# EAGLE design Transmitter_Schematic (EAGLE 6.5.0)
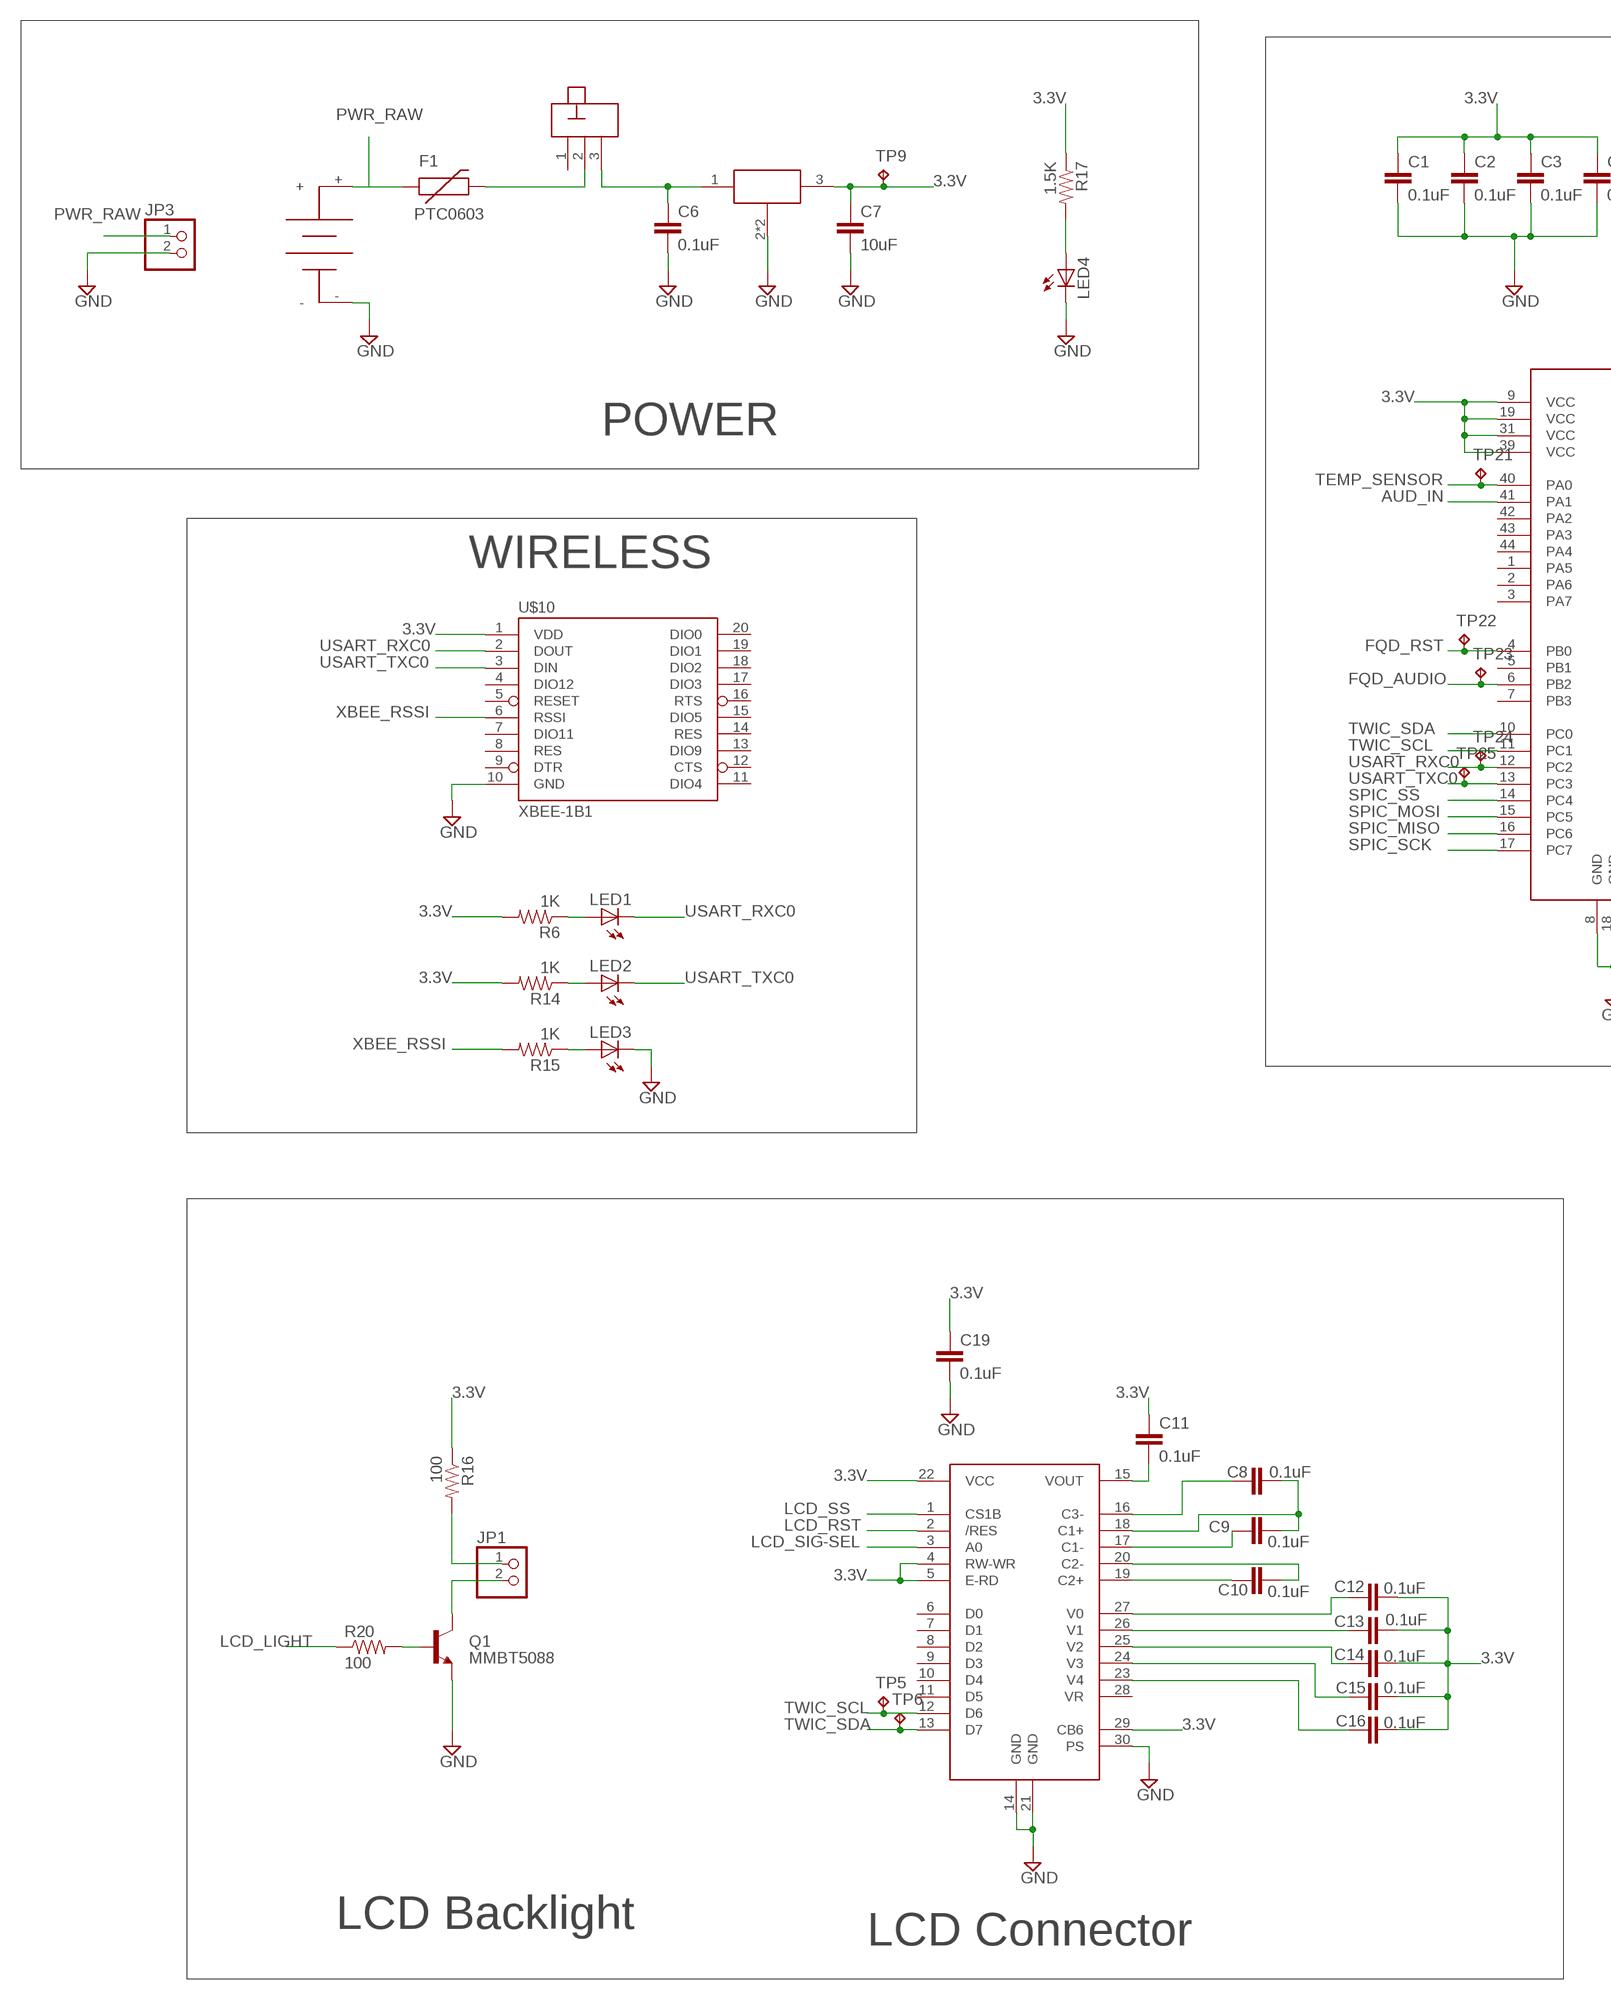
[diagram p0: schematic, sheet 1, part 1 of 2]
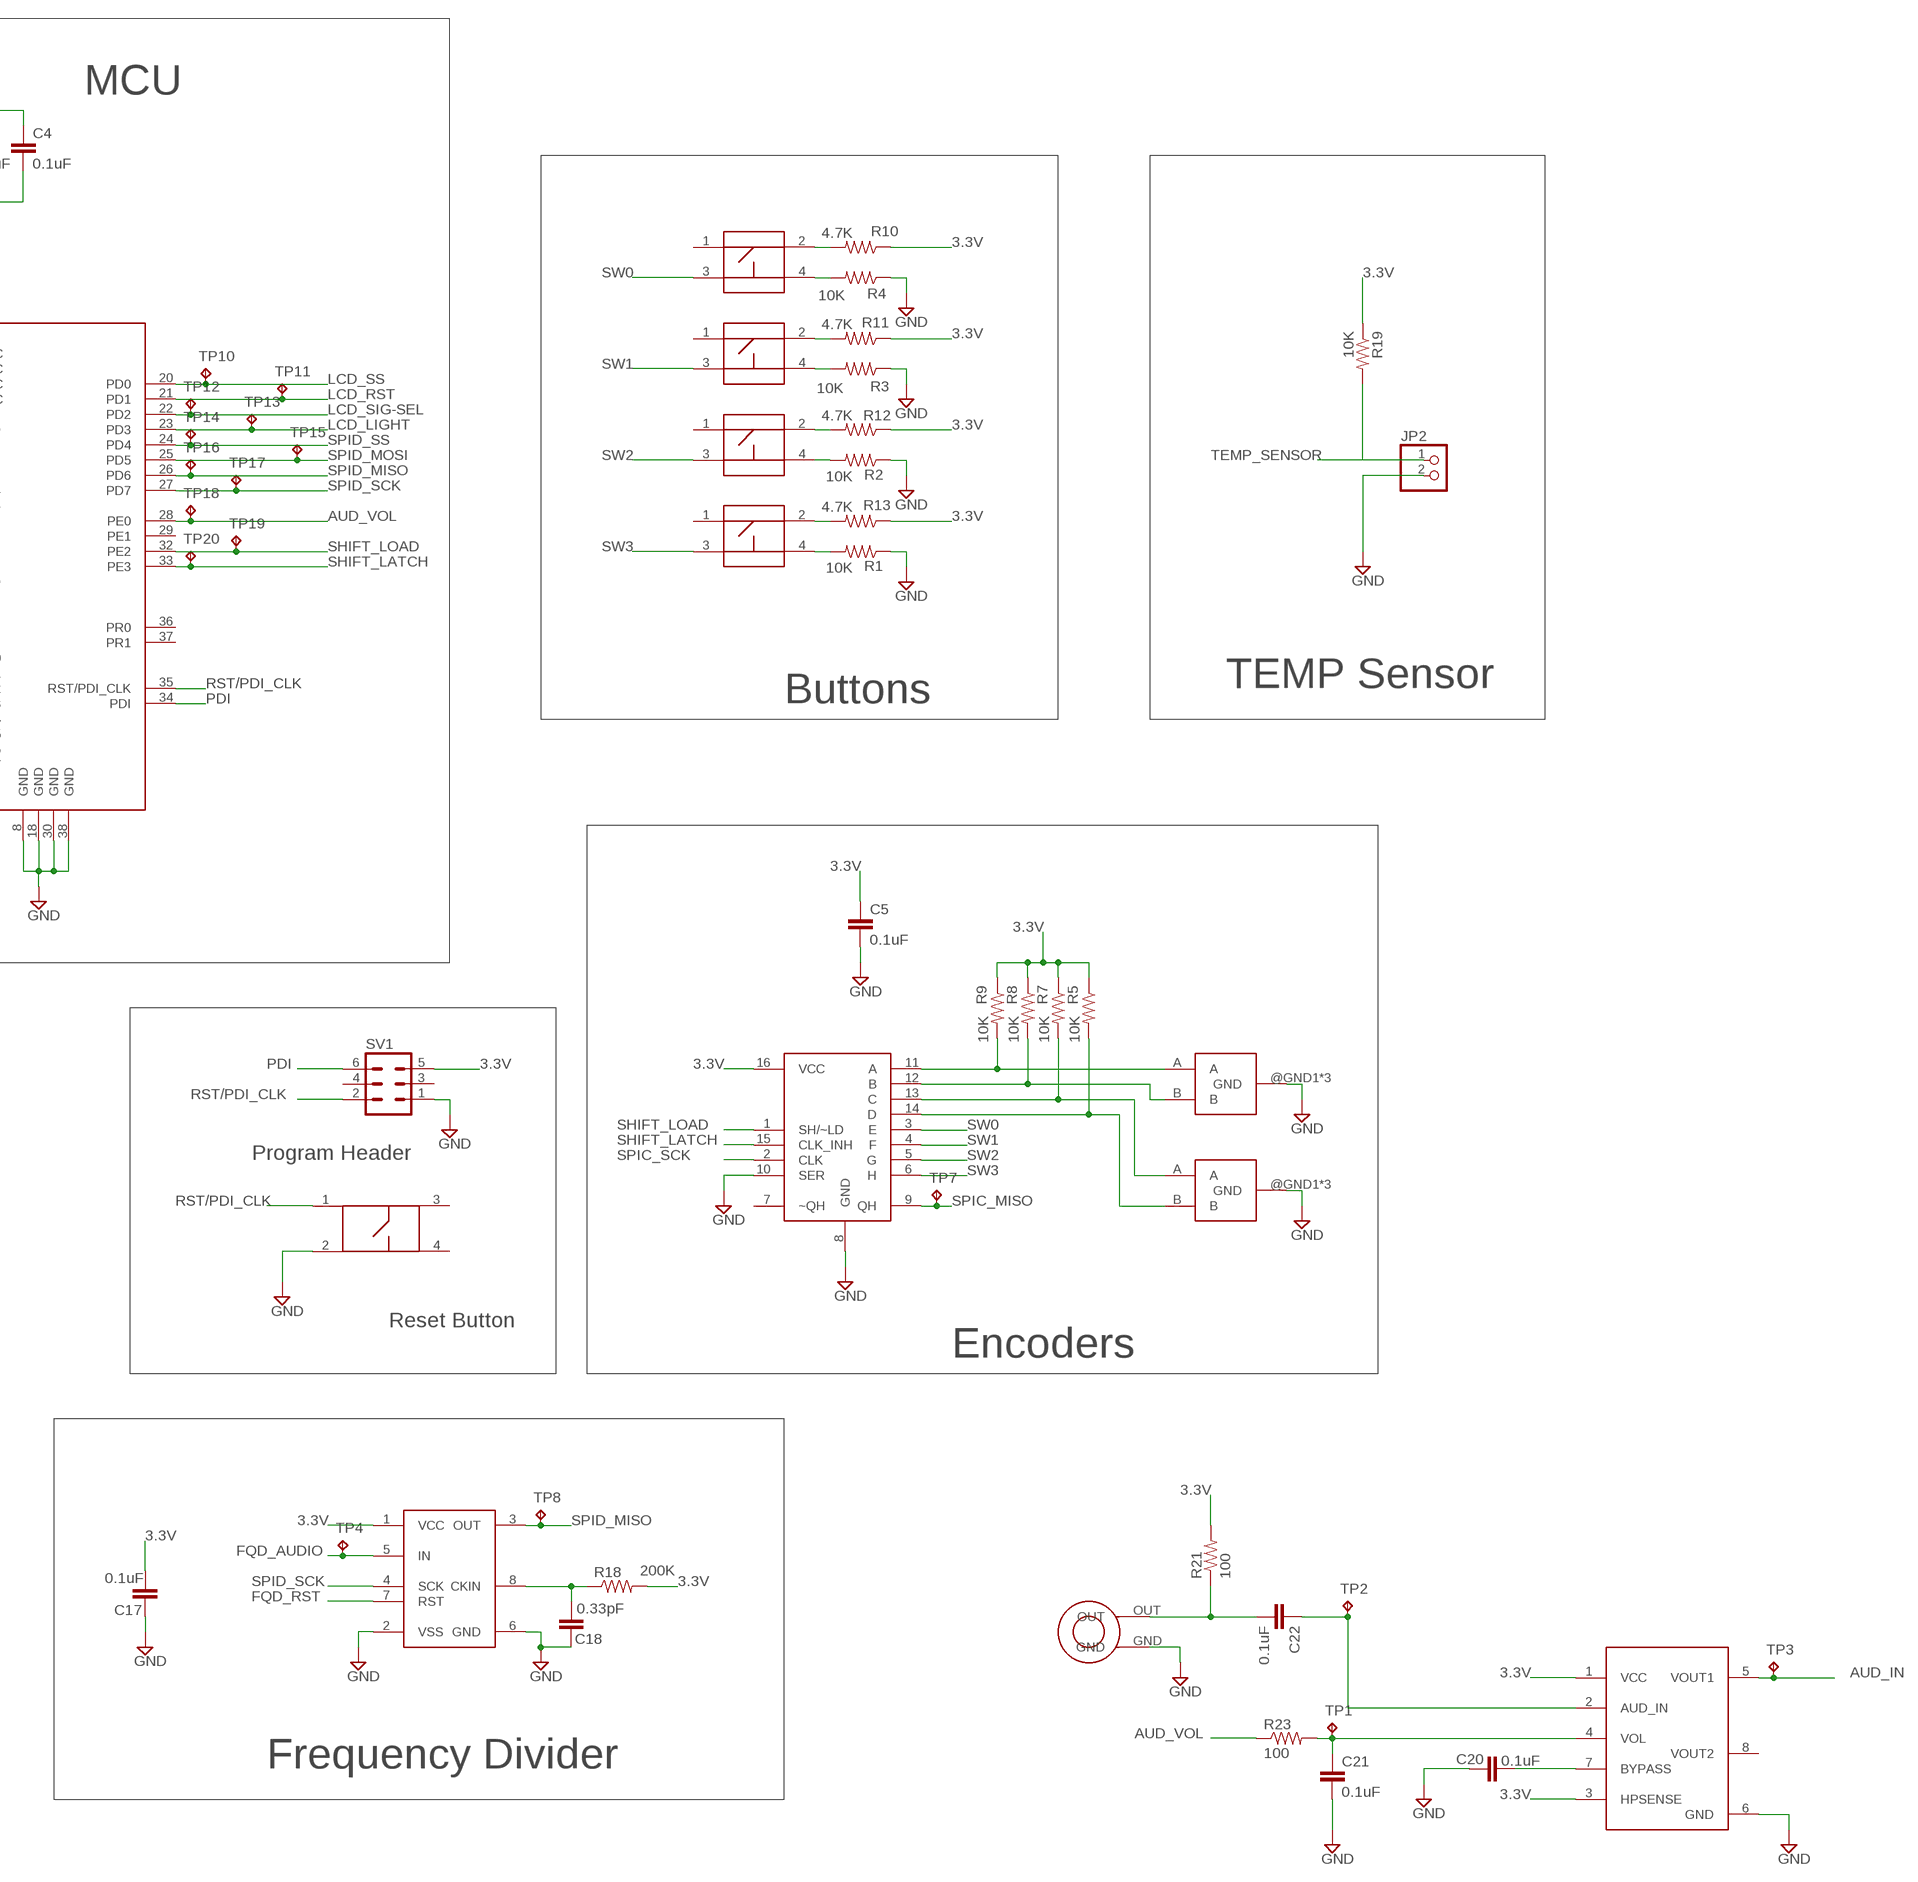
[diagram p1: schematic, sheet 1, part 2 of 2]

## Parts
C1  0.1uF  CAP0603-CAP  [0603-CAP]
C2  0.1uF  CAP0603-CAP  [0603-CAP]
C3  0.1uF  CAP0603-CAP  [0603-CAP]
C4  0.1uF  CAP0603-CAP  [0603-CAP]
C5  0.1uF  CAP0603-CAP  [0603-CAP]
C6  0.1uF  CAP0603-CAP  [0603-CAP]
C7  10uF  CAP0603-CAP  [0603-CAP]
C8  0.1uF  CAP0603-CAP  [0603-CAP]
C9  0.1uF  CAP0603-CAP  [0603-CAP]
C10  0.1uF  CAP0603-CAP  [0603-CAP]
C11  0.1uF  CAP0603-CAP  [0603-CAP]
C12  0.1uF  CAP0603-CAP  [0603-CAP]
C13  0.1uF  CAP0603-CAP  [0603-CAP]
C14  0.1uF  CAP0603-CAP  [0603-CAP]
C15  0.1uF  CAP0603-CAP  [0603-CAP]
C16  0.1uF  CAP0603-CAP  [0603-CAP]
C17  0.1uF  CAP0603-CAP  [0603-CAP]
C18  0.33pF  CAP0603-CAP  [0603-CAP]
C19  0.1uF  CAP0603-CAP  [0603-CAP]
C20  0.1uF  CAP0603-CAP  [0603-CAP]
C21  0.1uF  CAP0603-CAP  [0603-CAP]
C22  0.1uF  CAP0603-CAP  [0603-CAP]
F1  PTC0603  [0603]
JP1  PINHD-1X2  [1X02]
JP2  PINHD-1X2  [1X02]
JP3  PINHD-1X2  [1X02]
LED1  LED0603  [LED-0603]
LED2  LED0603  [LED-0603]
LED3  LED0603  [LED-0603]
LED4  LED0603  [LED-0603]
Q1  MMBT5088  TRANSISTOR_NPNMMBT5088  [SOT23]
R1  10K  RESISTOR0603  [0603-RES]
R2  10K  RESISTOR0603  [0603-RES]
R3  10K  RESISTOR0603  [0603-RES]
R4  10K  RESISTOR0603  [0603-RES]
R5  10K  RESISTOR0603  [0603-RES]
R6  1K  RESISTOR0603  [0603-RES]
R7  10K  RESISTOR0603  [0603-RES]
R8  10K  RESISTOR0603  [0603-RES]
R9  10K  RESISTOR0603  [0603-RES]
R10  4.7K  RESISTOR0603  [0603-RES]
R11  4.7K  RESISTOR0603  [0603-RES]
R12  4.7K  RESISTOR0603  [0603-RES]
R13  4.7K  RESISTOR0603  [0603-RES]
R14  1K  RESISTOR0603  [0603-RES]
R15  1K  RESISTOR0603  [0603-RES]
R16  100  RESISTOR0603  [0603-RES]
R17  1.5K  RESISTOR0603  [0603-RES]
R18  200K  RESISTOR0603  [0603-RES]
R19  10K  RESISTOR0603  [0603-RES]
R20  100  RESISTOR0603  [0603-RES]
R21  100  RESISTOR0603  [0603-RES]
R23  100  RESISTOR0603  [0603-RES]
SV1  MA03-2  [MA03-2]
SW0  SPARKFUN_TAC_BUTTONS  [SPARKFUN_TAC_BUTTONS]
SW1  SPARKFUN_TAC_BUTTONS  [SPARKFUN_TAC_BUTTONS]
SW2  SPARKFUN_TAC_BUTTONS  [SPARKFUN_TAC_BUTTONS]
SW3  SPARKFUN_TAC_BUTTONS  [SPARKFUN_TAC_BUTTONS]
TP1  TPPAD1-13  [P1-13]
TP2  TPPAD1-13  [P1-13]
TP3  TPPAD1-13  [P1-13]
TP4  TPPAD1-13  [P1-13]
TP5  TPPAD1-13  [P1-13]
TP6  TPPAD1-13  [P1-13]
TP7  TPPAD1-13  [P1-13]
TP8  TPPAD1-13  [P1-13]
TP9  TPPAD1-13  [P1-13]
TP10  TPPAD1-13  [P1-13]
TP11  TPPAD1-13  [P1-13]
TP12  TPPAD1-13  [P1-13]
TP13  TPPAD1-13  [P1-13]
TP14  TPPAD1-13  [P1-13]
TP15  TPPAD1-13  [P1-13]
TP16  TPPAD1-13  [P1-13]
TP17  TPPAD1-13  [P1-13]
TP18  TPPAD1-13  [P1-13]
TP19  TPPAD1-13  [P1-13]
TP20  TPPAD1-13  [P1-13]
TP21  TPPAD1-13  [P1-13]
TP22  TPPAD1-13  [P1-13]
TP23  TPPAD1-13  [P1-13]
TP24  TPPAD1-13  [P1-13]
TP25  TPPAD1-13  [P1-13]
U$1  ATXMEGA32A4UTQFP44  [QFP80P1200X1200X120-44N]
U$6  8B_SHIFT_REG  [TSSOP16]
U$7  MICRO_TAC_BUTTONS  [MICRO_TAC_BUTTONS]
U$8  ENCODER  [EVE_GE1F2012B]
U$9  ENCODER  [EVE_GE1F2012B]
U$10  XBEE-1B1  [XBEE-1]
U$11  LCD_CONNECTOR  [LCD_CONNECTOR]
U$12  3.3V_REG_LDO  [SOT223]
U$13  3XAA_BATT_HOLDER  [3XAA_BATT_HOLDER]
U$14  SWITCH_SLIDE  [SWITCH_SLIDE]
U$15  FREQUENCY_DIVIDER  [DIP08]
U$16  LM4875  [SOIC8]
U$17  MICROPHONE  [CMA-4544PF]

## Nets
3.3V: C1.1 C2.1 C3.1 C4.1 C5.1 C7.1 C11.1 C12.2 C13.2 C14.2 C15.2 C16.2 C17.2 C19.1 R5.1 R6.2 R7.1 R8.1 R9.1 R10.1 R11.1 R12.1 R13.1 R14.2 R16.1 R17.1 R18.2 R19.1 R21.2 SV1.5 TP9.TP U$1.9(VCC) U$1.19(VCC) U$1.31(VCC) U$1.39(VCC) U$6.16(VCC) U$10.1(VDD) U$11.4(RW-WR) U$11.5(E-RD) U$11.22(VCC) U$11.29(CB6) U$12.3 U$15.1(VCC) U$16.1(VCC) U$16.3(HPSENSE)
AUD_IN: TP3.TP U$1.41(PA1) U$16.5(VOUT1)
AUD_VOL: R23.1 TP18.TP U$1.28(PE0)
FQD_AUDIO: TP4.TP TP23.TP U$1.6(PB2) U$15.5(IN)
FQD_RST: TP22.TP U$1.4(PB0) U$15.7(RST)
GND: C1.2 C2.2 C3.2 C4.2 C5.2 C6.2 C7.2 C17.1 C18.1 C19.2 C20.1 C21.2 JP2.2 JP3.2 LED3.C LED4.C Q1.2(E) R1.1 R2.1 R3.1 R4.1 SV1.1 U$1.8(GND) U$1.18(GND) U$1.30(GND) U$1.38(GND) U$6.8(GND) U$6.10(SER) U$7.2 U$8.@GND1(GND) U$8.@GND2(GND) U$8.GND U$9.@GND1(GND) U$9.@GND2(GND) U$9.GND U$10.10(GND) U$11.14(GND) U$11.21(GND) U$11.30(PS) U$12.2 U$12.4 U$13.- U$15.2(VSS) U$15.6(GND) U$16.6(GND) U$17.GND
LCD_LIGHT: R20.1 TP13.TP U$1.23(PD3)
LCD_RST: TP11.TP U$1.21(PD1) U$11.2(/RES)
LCD_SIG-SEL: TP12.TP U$1.22(PD2) U$11.3(A0)
LCD_SS: TP10.TP U$1.20(PD0) U$11.1(CS1B)
MIC_IN: C22.1 TP2.TP U$16.2(AUD_IN)
N$1: R2.2 SW2.4
N$2: C6.1 U$12.1 U$14.3
N$4: C8.1 U$11.16(C3-)
N$5: C8.2 C9.2 U$11.18(C1+)
N$6: R3.2 SW1.4
N$7: R4.2 SW0.4
N$8: R1.2 SW3.4
N$9: R5.2 U$6.14(D) U$9.B
N$10: C9.1 U$11.17(C1-)
N$11: R9.2 U$6.11(A) U$8.A
N$12: R8.2 U$6.12(B) U$8.B
N$13: R7.2 U$6.13(C) U$9.A
N$14: C10.2 U$11.20(C2-)
N$15: R10.2 SW0.2
N$16: R11.2 SW1.2
N$17: R12.2 SW2.2
N$18: R13.2 SW3.2
N$19: C10.1 U$11.19(C2+)
N$20: C12.1 U$11.27(V0)
N$21: C13.1 U$11.26(V1)
N$22: C14.1 U$11.25(V2)
N$23: C15.1 U$11.24(V3)
N$24: C16.1 U$11.23(V4)
N$25: JP1.1 R16.2
N$26: C11.2 U$11.15(VOUT)
N$27: JP1.2 Q1.3(C)
N$28: F1.2 U$14.2
N$29: LED1.A R6.1
N$30: LED2.A R14.1
N$31: LED3.A R15.1
N$32: LED4.A R17.2
N$33: Q1.1(B) R20.2
N$34: C22.2 R21.1 U$17.OUT
N$35: C21.1 R23.2 TP1.TP U$16.4(VOL)
N$37: C20.2 U$16.7(BYPASS)
N$40: C18.2 R18.1 U$15.8(CKIN)
PDI: SV1.6 U$1.34(PDI)
PWR_RAW: F1.1 JP3.1 U$13.+
RST/PDI_CLK: SV1.2 U$1.35(RST/PDI_CLK) U$7.1
SHIFT_LATCH: TP20.TP U$1.33(PE3) U$6.15(CLK_INH)
SHIFT_LOAD: TP19.TP U$1.32(PE2) U$6.1(SH/~LD)
SPIC_MISO: TP7.TP U$1.16(PC6) U$6.9(QH)
SPIC_MOSI: U$1.15(PC5)
SPIC_SCK: U$1.17(PC7) U$6.2(CLK)
SPIC_SS: U$1.14(PC4)
SPID_MISO: TP8.TP TP16.TP U$1.26(PD6) U$15.3(OUT)
SPID_MOSI: TP15.TP U$1.25(PD5)
SPID_SCK: TP17.TP U$1.27(PD7) U$15.4(SCK)
SPID_SS: TP14.TP U$1.24(PD4)
SW0: SW0.3 U$6.3(E)
SW1: SW1.3 U$6.4(F)
SW2: SW2.3 U$6.5(G)
SW3: SW3.3 U$6.6(H)
TEMP_SENSOR: JP2.1 R19.2 TP21.TP U$1.40(PA0)
TWIC_SCL: TP5.TP U$1.11(PC1) U$11.12(D6)
TWIC_SDA: TP6.TP U$1.10(PC0) U$11.13(D7)
USART_RXC0: LED1.C TP24.TP U$1.12(PC2) U$10.2(DOUT)
USART_TXC0: LED2.C TP25.TP U$1.13(PC3) U$10.3(DIN)
XBEE_RSSI: R15.2 U$10.6(RSSI)
Unconnected: SV1.3 SV1.4 SW0.1 SW1.1 SW2.1 SW3.1 U$1.1(PA5) U$1.2(PA6) U$1.3(PA7) U$1.5(PB1) U$1.7(PB3) U$1.29(PE1) U$1.36(PR0) U$1.37(PR1) U$1.42(PA2) U$1.43(PA3) U$1.44(PA4) U$6.7(~QH) U$7.3 U$7.4 U$10.4(DIO12) U$10.5(RESET) U$10.7(DIO11) U$10.8(RES) U$10.9(DTR) U$10.11(DIO4) U$10.12(CTS) U$10.13(DIO9) U$10.14(RES) U$10.15(DIO5) U$10.16(RTS) U$10.17(DIO3) U$10.18(DIO2) U$10.19(DIO1) U$10.20(DIO0) U$11.6(D0) U$11.7(D1) U$11.8(D2) U$11.9(D3) U$11.10(D4) U$11.11(D5) U$11.28(VR) U$14.1 U$16.8(VOUT2)

## Notes on the sheet
- MCU
- POWER
- WIRELESS
- TEMP Sensor
- Buttons
- Program Header
- Reset Button
- Encoders
- LCD Backlight
- LCD Connector | Frequency Divider

## Library data of the parts
C1-C22 = SparkFun-Capacitors:CAP: Capacitor Standard 0603 ceramic capacitor, and 0.1" leaded capacitor.
F1 = SparkFun-PowerIC:PTC: Resettable Fuse PTC Resettable Fuse. Spark Fun Electronics SKU : COM-08357
JP1-JP3 = pinhead:PINHD-1X2: PIN HEADER
LED1-LED4 = SparkFun-LED:LED: LEDs Standard schematic elements and footprints for 5mm, 3mm, 1206, and 0603 sized LEDs. 5mm - Spark Fun Electronics SKU : COM-00529 (and others)
Q1 = SparkFun-DiscreteSemi:TRANSISTOR_NPN: Generic NPN BJT MMBT2222A - TRANS-08049 (SOT-23, 1A 40V) MPSA42 - TRANS-09116 (SOT-23, 500mA 300V) MMBT5088LT1G - TRANS-11160 (SOT-23, 50 mA 30V); PROD_ID: TRANS-11160
R1-R21 R23 = SparkFun-Resistors:RESISTOR: Resistor Basic schematic elements and footprints for 0603, 1206, and PTH resistors.
SV1 = con-lstb:MA03-2: PIN HEADER; OC_FARNELL: unknown; OC_NEWARK: unknown
SW0 SW1-SW3 = TuansLib:SPARKFUN_TAC_BUTTONS
TP1-TP25 = testpad:TP: Test pad
U$1 = TuansLib:ATXMEGA32A4U
U$6 = TuansLib:8B_SHIFT_REG
U$7 = TuansLib:MICRO_TAC_BUTTONS
U$8 U$9 = TuansLib:ENCODER
U$10 = SparkFun-RF:XBEE-1: Xbee module footprints SMT header is CONN-09042.
U$11 = TuansLib:LCD_CONNECTOR
U$12 = TuansLib:3.3V_REG_LDO
U$13 = TuansLib:3XAA_BATT_HOLDER
U$14 = TuansLib:SWITCH_SLIDE
U$15 = TuansLib:FREQUENCY_DIVIDER
U$16 = TuansLib:LM4875
U$17 = TuansLib:MICROPHONE

## Board
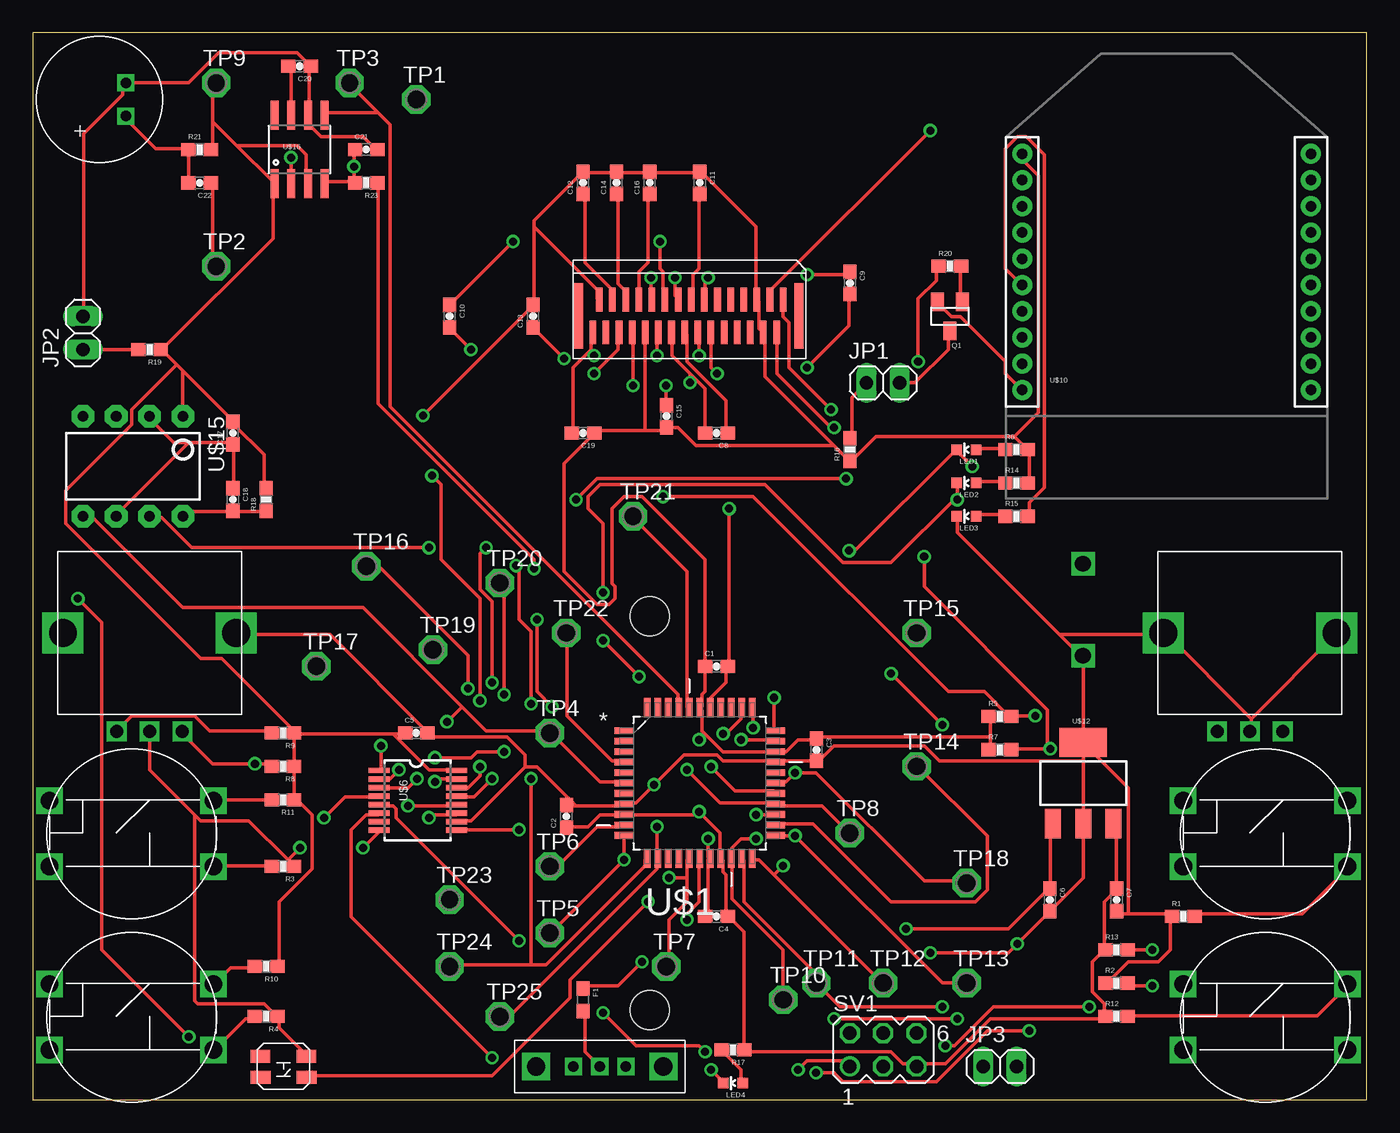
[diagram p2: board, top side]
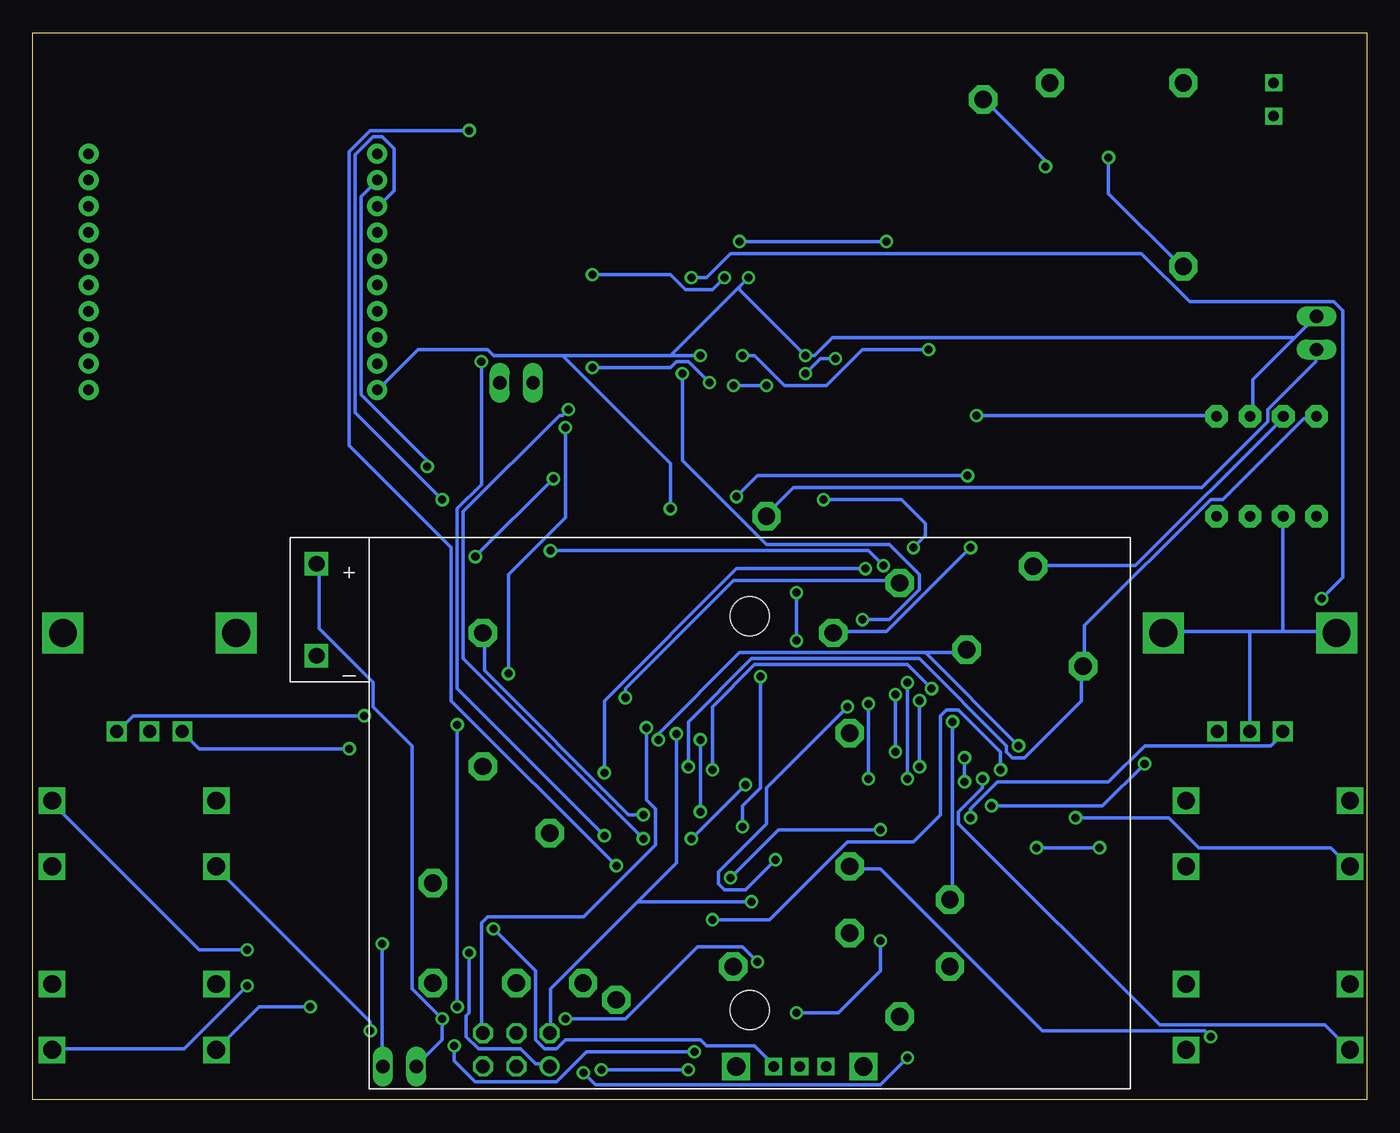
[diagram p3: board, bottom side, seen from below]

Size 101.6 x 81.28 mm. Coordinates in mm from the lower left corner, seen from the top.
Outline: 0,0 101.6,0 101.6,81.28 0,81.28 0,0
Copper layers (1*16): Top 0.035mm / dielectric 1.5mm / Bottom 0.035mm
Design rules "default": minimum track width 10mil, minimum drill 24mil, track to track 8mil, track to pad 8mil, pad to pad 8mil, via to via 8mil, smd to smd 8mil, copper to edge 40mil, drill to drill 8mil, minimum pad ring 10mil, minimum via ring 8mil, stop-mask expansion 4mil, vias tented up to drill 0mil, thermal gap 10mil

### Footprints (pad centres in the part's own frame; a part is rotated, then mirrored left to right if it is on the bottom)
0603-CAP = smd 1.1 x 1: 1 -0.85,0; 2 0.85,0
0603 = smd 1.1 x 1: 1 -0.85,0; 2 0.85,0
1X02 = drill 1.016 long: 1 -1.27,0; 2 1.27,0
LED-0603 = smd 0.8 x 0.8: A 0,-0.75; C 0,0.75
SOT23 = smd 1 x 1.4: 1 -0.95,-1.1; 2 0.95,-1.1; 3 0,1.1
0603-RES = smd 1.1 x 1: 1 -0.85,0; 2 0.85,0
MA03-2 = drill 1.016: 1 -2.54,-1.27 | drill 1.016 octagon: 2 -2.54,1.27; 3 0,-1.27; 4 0,1.27; 5 2.54,-1.27; 6 2.54,1.27
SPARKFUN_TAC_BUTTONS = drill 1.346 square: 1 0,5.004; 2 12.497,5.004; 3 0,0; 4 12.497,0
P1-13 = drill 1.321 pad 2.159 octagon: TP 0,0
QFP80P1200X1200X120-44N = smd 1.473 x 0.508: 1 -5.74,3.988; 2 -5.74,3.2; 3 -5.74,2.388; 4 -5.74,1.6; 5 -5.74,0.787; 6 -5.74,0; 7 -5.74,-0.787; 8 -5.74,-1.6; 9 -5.74,-2.388; 10 -5.74,-3.2; 11 -5.74,-3.988; 23 5.74,-3.988; 24 5.74,-3.2; 25 5.74,-2.388; 26 5.74,-1.6; 27 5.74,-0.787; 28 5.74,0; 29 5.74,0.787; 30 5.74,1.6; 31 5.74,2.388; 32 5.74,3.2; 33 5.74,3.988 | smd 0.508 x 1.473: 12 -3.988,-5.74; 13 -3.2,-5.74; 14 -2.388,-5.74; 15 -1.6,-5.74; 16 -0.787,-5.74; 17 0,-5.74; 18 0.787,-5.74; 19 1.6,-5.74; 20 2.388,-5.74; 21 3.2,-5.74; 22 3.988,-5.74; 34 3.988,5.74; 35 3.2,5.74; 36 2.388,5.74; 37 1.6,5.74; 38 0.787,5.74; 39 0,5.74; 40 -0.787,5.74; 41 -1.6,5.74; 42 -2.388,5.74; 43 -3.2,5.74; 44 -3.988,5.74
TSSOP16 = smd 0.4 x 1.6: 1 -2.225,-2.85; 2 -1.575,-2.85; 3 -0.925,-2.85; 4 -0.275,-2.85; 5 0.375,-2.85; 6 1.025,-2.85; 7 1.675,-2.85; 8 2.325,-2.85; 9 2.325,3.05; 10 1.675,3.05; 11 1.025,3.05; 12 0.375,3.05; 13 -0.275,3.05; 14 -0.925,3.05; 15 -1.575,3.05; 16 -2.225,3.05
MICRO_TAC_BUTTONS = smd 1.524 x 1: 1 0.75,2.1; 3 4.25,2.1 | smd 1.5 x 1: 2 0.75,0.5; 4 4.25,0.5
EVE_GE1F2012B = drill 2.1 square: @GND1 -6.6,0; @GND2 6.6,0 | drill 1 square: A -2.5,-7.5; B 2.5,-7.5; GND 0,-7.5
XBEE-1 = drill 0.8 pad 1.524: 1 -11,20; 2 -11,18; 3 -11,16; 4 -11,14; 5 -11,12; 6 -11,10; 7 -11,8; 8 -11,6; 9 -11,4; 10 -11,2; 11 11,2; 12 11,4; 13 11,6; 14 11,8; 15 11,10; 16 11,12; 17 11,14; 18 11,16; 19 11,18; 20 11,20
LCD_CONNECTOR = smd 0.5 x 1.8: 1 0,0; 2 -0.5,-2.5; 3 -1,0; 4 -1.5,-2.5; 5 -2,0; 6 -2.5,-2.5; 7 -3,0; 8 -3.5,-2.5; 9 -4,0; 10 -4.5,-2.5; 11 -5,0; 12 -5.5,-2.5; 13 -6,0; 14 -6.5,-2.5; 15 -7,0; 16 -7.5,-2.5; 17 -8,0; 18 -8.5,-2.5; 19 -9,0; 20 -9.5,-2.5; 21 -10,0; 22 -10.5,-2.5; 23 -11,0; 24 -11.5,-2.5; 25 -12,0; 26 -12.5,-2.5; 27 -13,0; 28 -13.5,-2.5; 29 -14,0; 30 -14.5,-2.5 | smd 0.7 x 5: 31 1.2,-1.25; 32 -15.6,-1.25
SOT223 = smd 1.219 x 2.235: 1 -2.311,-3.099; 2 0,-3.099; 3 2.311,-3.099 | smd 3.6 x 2.2: 4 0,3.099
3XAA_BATT_HOLDER = drill 1.2 square: + 33,-4; - 33,3 | hole 3: 0,30; 0,0
SWITCH_SLIDE = drill 0.8 square: 1 -2,0; 2 0,0; 3 2,0 | drill 1.41 square: P$4 4.85,0 | drill 1.4 square: P$5 -4.85,0
DIP08 = drill 0.813 pad 1.727 octagon: 1 -3.81,-3.81; 2 -1.27,-3.81; 3 1.27,-3.81; 4 3.81,-3.81; 5 3.81,3.81; 6 1.27,3.81; 7 -1.27,3.81; 8 -3.81,3.81
SOIC8 = smd 0.61 x 2.21: 1 -1.905,-2.616; 2 -0.635,-2.616; 3 0.635,-2.616; 4 1.905,-2.616; 5 1.905,2.616; 6 0.635,2.616; 7 -0.635,2.616; 8 -1.905,2.616
CMA-4544PF = drill 0.8 square: GND 2,1.27; OUT 2,-1.27

### Placement (x,y rotation side)
C1  52.07,33.02 0 top
C2  40.64,21.59 90 top
C3  59.69,26.67 270 top
C4  52.07,13.97 180 top
C5  29.21,27.94 0 top
C6  77.47,15.24 270 top
C7  82.55,15.24 270 top
C8  52.07,50.8 180 top
C9  62.23,62.23 270 top
C10  31.75,59.69 270 top
C11  50.8,69.85 270 top
C12  41.91,69.85 90 top
C13  38.1,59.69 90 top
C14  44.45,69.85 90 top
C15  48.26,52.07 270 top
C16  46.99,69.85 90 top
C17  15.24,50.8 90 top
C18  15.24,45.72 270 top
C19  41.91,50.8 180 top
C20  20.32,78.74 180 top
C21  25.4,72.39 0 top
C22  12.7,69.85 180 top
F1  41.91,7.62 270 top
JP1  64.77,54.61 0 top
JP2  3.81,58.42 90 top
JP3  73.66,2.54 0 top
LED1  71.12,49.53 90 top
LED2  71.12,46.99 90 top
LED3  71.12,44.45 90 top
LED4  53.34,1.27 90 top
Q1  69.85,59.69 180 top
R1  87.63,13.97 0 top
R2  82.55,8.89 0 top
R3  19.05,17.78 180 top
R4  17.78,6.35 180 top
R5  73.66,29.21 0 top
R6  74.93,49.53 0 top
R7  73.66,26.67 0 top
R8  19.05,25.4 180 top
R9  19.05,27.94 180 top
R10  17.78,10.16 180 top
R11  19.05,22.86 180 top
R12  82.55,6.35 0 top
R13  82.55,11.43 0 top
R14  74.93,46.99 0 top
R15  74.93,44.45 0 top
R16  62.23,49.53 90 top
R17  53.34,3.81 180 top
R18  17.78,45.72 90 top
R19  8.89,57.15 180 top
R20  69.85,63.5 0 top
R21  12.7,72.39 0 top
R23  25.4,69.85 180 top
SV1  64.77,3.81 0 top
SW0  1.27,3.81 0 top
SW1  1.27,17.78 0 top
SW2  87.63,3.81 0 top
SW3  87.63,17.78 0 top
TP1  29.21,76.2 0 top
TP2  13.97,63.5 0 top
TP3  24.13,77.47 0 top
TP4  39.37,27.94 0 top
TP5  39.37,12.7 0 top
TP6  39.37,17.78 0 top
TP7  48.26,10.16 0 top
TP8  62.23,20.32 0 top
TP9  13.97,77.47 0 top
TP10  57.15,7.62 0 top
TP11  59.69,8.89 0 top
TP12  64.77,8.89 0 top
TP13  71.12,8.89 0 top
TP14  67.31,25.4 0 top
TP15  67.31,35.56 0 top
TP16  25.4,40.64 0 top
TP17  21.59,33.02 0 top
TP18  71.12,16.51 0 top
TP19  30.48,34.29 0 top
TP20  35.56,39.37 0 top
TP21  45.72,44.45 0 top
TP22  40.64,35.56 0 top
TP23  31.75,15.24 0 top
TP24  31.75,10.16 0 top
TP25  35.56,6.35 0 top
U$1  50.8,24.13 0 top
U$6  29.21,22.86 270 top
U$7  21.59,3.81 180 top
U$8  8.89,35.56 0 top
U$9  92.71,35.56 0 top
U$10  86.36,52.07 0 top
U$11  57.15,60.96 0 top
U$12  80.01,24.13 0 top
U$13  46.99,36.83 180 bottom
U$14  43.18,2.54 0 top
U$15  7.62,48.26 180 top
U$16  20.32,72.39 0 top
U$17  5.08,76.2 0 top

### Tracks (layer width: path | path; a pad name or v marks a point on that pad's centre or on a via)
3.3V  (via drill 0.61)
  Top 0.254: 72.92,27.66 72.92,29.03 R5.1 | 72.92,27.66 72.92,26.75 R7.1 | 72.92,27.66 59.89,27.66 C3.1 59.66,27.43 58.29,27.43 57.38,26.52 U$1.31 52.58,26.52 51.21,27.89 | 51.21,27.89 50.98,28.12 50.98,29.72 U$1.39 50.98,29.95 50.98,30.86 51.21,31.09 51.21,32.92 C1.1 51.21,33.15 51.21,41.15 46.41,45.95 45.03,45.95 44.12,45.03 44.12,39.32 44.35,39.09 44.35,38.18 43.89,37.72 42.98,37.72 40.46,40.23 40.46,48.46 42.75,50.75 C19.1 42.98,50.98 46.63,50.98 | 81.61,11.43 80.7,10.52 80.7,8.23 81.61,7.32 81.61,6.4 R12.1 81.61,6.17 72.92,6.17 69.49,2.74 67.44,2.74 SV1.5 67.21,2.74 66.29,2.74 65.38,3.66 54.41,3.66 R17.1 54.18,3.89 54.18,12.8 53.03,13.95 C4.1 52.81,14.17 52.81,17.14 52.58,17.37 52.58,18.29 U$1.19 52.35,18.52 52.35,20.34 50.98,21.72 50.75,21.72 | U$12.3 82.53,21.03 82.53,16.23 C7.1 82.53,16 81.61,15.09 81.61,11.43 | 81.61,11.43 R13.1 | C2.1 40.69,20.8 42.29,20.8 43.2,21.72 45.03,21.72 U$1.9 45.26,21.72 50.75,21.72 | v50.75,27.43 51.21,27.89 | 50.75,21.72 v50.75,21.95 | 38.18,66.52 38.18,66.98 41.83,70.64 C12.2 42.06,70.64 44.35,70.64 C14.2 44.58,70.64 46.86,70.64 C16.2 47.09,70.64 50.75,70.64 C11.1 50.98,70.64 55.09,66.52 55.09,61.04 U$11.5 55.32,60.81 55.32,58.75 55.55,58.52 U$11.4 55.78,58.29 55.78,55.09 61.04,49.84 | 38.18,66.52 38.18,60.58 C13.2 37.95,60.35 v29.72,52.12 | 38.18,66.52 42.98,61.72 42.98,61.04 U$11.29 | 46.63,50.98 48.01,50.98 48.23,51.21 C15.2 48.46,51.21 49.15,51.21 50.52,49.84 61.04,49.84 | 46.63,50.98 46.63,58.29 U$11.22 | R14.2 75.89,47.09 75.89,49.38 R6.2 75.67,49.61 74.75,50.52 | 61.04,49.84 62.18,48.69 R16.1 62.41,48.69 64.24,50.52 74.75,50.52
  Top 0.254: 74.75,50.52 76.58,52.35 76.58,70.41 75.44,71.55 75.44,72.01 U$10.1 | R10.1 18.75,10.29 18.75,15.09 21.26,17.6 21.26,21.72 20.12,22.86 R11.1 19.89,22.86 19.89,25.38 R8.1 19.89,25.6 19.89,27.89 R9.1 | 27.43,27.89 20.12,27.89 R9.1 | 27.43,27.89 28.35,27.89 C5.1 | 27.43,27.89 30.18,25.15 32.23,25.15 U$6.16 | 11.43,55.55 15.32,51.66 C17.2 15.32,51.44 17.6,49.15 17.6,46.63 R18.2 | 11.43,55.55 10.97,56.01 | 10.97,56.01 9.83,57.15 | 11.43,55.55 U$15.1 | 13.72,74.52 13.72,77.04 13.95,77.27 TP9.TP | 13.72,74.52 13.72,72.47 R21.2 | 13.72,74.52 15.54,72.69 | 15.54,72.69 18.29,69.95 U$16.1 18.29,69.72 18.29,65.61 9.83,57.15 | 15.54,72.69 20.12,72.69 20.8,72.01 20.8,69.95 U$16.3 | 9.83,57.15 R19.1 | 10.97,56.01 7.54,52.58 7.54,51.44 2.52,46.41 2.52,43.89 12.8,33.6 14.4,33.6 19.89,28.12 R9.1
  Bottom 0.254: v50.75,21.95 v50.75,27.43 | v29.72,52.12 11.43,52.12 U$15.1
AUD_IN
  Top 0.254: 26.29,75.21 24.23,77.27 TP3.TP | 26.29,75.21 27.2,74.3 27.2,52.81 49.15,30.86 49.15,29.95 U$1.41 | 26.29,75.21 22.4,75.21 U$16.5
AUD_VOL  (via drill 0.61)
  Top 0.254: v38.18,40.46 38.18,41.15 26.29,53.03 26.29,69.72 R23.1 | U$1.28 56.69,24.23 57.38,24.23 v58.06,24.92 59.66,24.92 67.89,16.69 71.09,16.69 TP18.TP
  Bottom 0.254: v38.18,40.46 48.01,40.46 58.06,30.4 v58.06,24.92
FQD_AUDIO  (via drill 0.61)
  Top 0.254: U$1.6 45.03,24.23 43.2,24.23 39.55,27.89 TP4.TP 39.32,28.12 34.52,28.12 32.69,29.95 | 32.69,29.95 25.15,37.49 11.43,37.49 4.57,44.35 3.89,44.35 U$15.5 | 32.69,29.95 v31.55,28.8
  Bottom 0.254: v31.55,28.8 31.55,15.32 TP23.TP
FQD_RST  (via drill 0.61)
  Top 0.254: U$1.4 45.03,25.83 44.12,25.83 40.69,29.26 40.69,35.43 TP22.TP | v30.18,42.06 12.12,42.06 9.83,44.35 8.91,44.35 U$15.7
  Bottom 0.254: v30.18,42.06 36.58,35.66 40.46,35.66 TP22.TP
GND  (via drill 0.61)
  Top 0.254: v51.66,2.29 52.58,1.37 LED4.C | v58.29,2.29 58.98,2.97 61.95,2.97 62.18,2.74 SV1.1 | v68.35,11.2 74.3,11.2 v74.98,11.89 77.27,14.17 C6.2 77.5,14.4 80.01,16.92 U$12.2 80.01,25.83 | 92.81,29.03 92.81,28.12 U$9.GND | 92.81,29.03 99.21,35.43 U$9.@GND2 | R2.1 81.84,8.91 83.44,10.52 85.72,10.52 86.64,11.43 86.64,13.95 R1.1 86.64,14.17 83.44,14.17 | 83.44,14.17 82.75,14.17 C7.2 | 78.18,35.43 79.78,33.83 U$13.- 80.01,33.6 U$12.4 80.01,27.2 | 78.18,35.43 70.41,43.2 70.41,44.35 LED3.C | 83.44,14.17 83.44,23.77 80.01,27.2 | 78.18,35.43 85.95,35.43 U$9.@GND1 86.18,35.66 92.81,29.03 | 80.01,27.2 80.01,25.83 | 42.29,56.92 42.52,57.15 42.52,58.29 U$11.30 | 42.29,56.92 41.15,55.78 41.15,50.98 C19.2 | U$1.38 51.66,29.95 51.66,30.63 52.81,31.77 52.81,32.92 C1.2 53.03,33.15 v53.03,45.03 | Q1.2 69.04,60.58 69.95,59.66 70.64,59.66 74.07,56.24 74.07,55.32 75.21,54.18 U$10.10 | v50.75,56.69 50.75,58.29 U$11.14 | v47.09,62.64 47.09,61.04 U$11.21 | 42.29,56.92 42.52,56.92 v42.75,56.69 | C21.2 26.06,72.47 25.15,73.38 21.95,73.38 21.03,74.3 21.03,74.98 U$16.6 21.03,75.21 21.03,78.64 C20.1 21.03,78.87 20.12,79.78 14.17,79.78 11.89,77.5 7.09,77.5 U$17.GND 6.86,77.27 6.86,76.58 3.89,73.61 3.89,59.89 JP2.2 | C18.1 15.32,46.63 15.32,49.84 C17.1 15.09,50.06 11.89,50.06 | 11.89,50.06 10.74,50.06 8.91,51.89 U$15.2 | 11.89,50.06 6.4,44.58 U$15.6 | U$7.2 20.8,3.43 18.75,5.49 18.75,6.17 R4.1 18.52,6.4 17.6,7.32 12.57,7.32 12.34,7.54 12.34,21.72 | 19.43,18.29 16.46,21.26 12.8,21.26 12.34,21.72 | 19.43,18.29 19.89,17.83 R3.1 | 12.34,21.72 8.91,25.15 8.91,27.89 U$8.GND | v25.15,19.2 26.29,20.34 U$6.8
  Top 0.254: 19.43,18.29 v20.34,19.2 | C4.2 51.44,14.17 51.44,18.29 U$1.18 51.44,18.52 v51.44,19.89 | 41.38,22.4 45.03,22.4 U$1.8 45.26,22.63 45.95,22.63 v47.32,24 49.61,26.29 52.12,26.29 52.58,25.83 56.46,25.83 U$1.30 56.69,25.83 59.66,25.83 C3.2 59.89,25.83 61.04,26.98 67.89,26.98 69.04,25.83 80.01,25.83 | 41.38,22.4 40.69,22.4 C2.2 | 37.49,25.38 33.38,21.26 32.46,21.26 U$6.10 | 37.49,25.38 38.41,25.38 41.38,22.4 | U$8.@GND2 15.54,35.43 22.63,35.43 29.95,28.12 C5.2 30.18,27.89 30.4,27.66 36.12,27.66 37.49,26.29 37.49,25.38
  Bottom 0.254: v58.29,2.29 v51.66,2.29 | v74.98,11.89 74.98,2.74 JP3.2 | v68.35,11.2 68.35,6.63 68.58,6.4 68.58,4.8 67.67,3.89 64.47,3.89 63.32,2.74 62.41,2.74 SV1.1 | 61.27,56.69 66.52,56.69 66.98,57.15 72.24,57.15 75.21,54.18 U$10.10 | 61.27,56.69 53.03,56.69 | 53.03,56.69 v50.75,56.69 | 53.03,56.69 47.78,61.95 | 47.78,61.95 v47.09,62.64 | v53.03,45.03 53.03,48.46 61.27,56.69 | 47.78,61.95 47.78,61.72 v42.75,56.69 42.06,56.69 40.69,58.06 5.49,58.06 | 5.49,58.06 8.69,54.86 8.69,52.12 U$15.2 | 5.49,58.06 3.89,59.66 JP2.2 | v20.34,19.2 v25.15,19.2 | v47.32,24 v51.44,19.89 | 8.91,35.66 15.32,35.66 U$8.@GND2 | 8.91,35.66 6.4,35.66 | 6.4,35.66 2.52,35.66 U$8.@GND1 | 8.91,35.66 8.91,28.12 U$8.GND | 6.4,35.66 6.4,44.35 U$15.6
LCD_LIGHT  (via drill 0.61)
  Top 0.254: v67.44,56.24 67.44,61.04 68.81,62.41 68.81,63.32 R20.1 | U$1.23 56.69,20.12 v58.06,20.12 69.27,8.91 71.09,8.91 TP13.TP
  Bottom 0.254: v67.44,56.24 67.44,46.86 69.27,45.03 69.27,31.32 v58.06,20.12
LCD_RST  (via drill 0.61)
  Top 0.254: U$1.21 54.18,18.29 54.18,15.09 59.66,9.6 59.66,8.91 TP11.TP 61.49,7.09 v69.27,7.09 | v61.04,51.21 60.81,51.21 56.69,55.32 56.69,58.29 U$11.2 | v69.27,28.57 v65.38,32.46
  Bottom 0.254: v61.04,51.21 61.04,44.35 65.38,40.01 v65.38,32.46 | v69.27,7.09 v69.27,28.57
LCD_SIG-SEL  (via drill 0.61)
  Top 0.254: 56.46,17.14 64.69,8.91 TP12.TP | 56.46,17.14 55.32,18.29 54.86,18.29 U$1.22 | v68.35,73.84 56.24,61.72 56.24,61.04 U$11.3 | 56.46,17.14 v57.15,17.83
  Bottom 0.254: v68.35,73.84 75.89,73.84 77.5,72.24 77.5,49.84 69.72,42.06 69.72,30.4 v57.15,17.83
LCD_SS  (via drill 0.61)
  Top 0.254: TP10.TP 57.15,11.43 53.26,15.32 53.26,18.29 U$1.20 53.26,18.52 53.26,19.2 53.95,19.89 v55.09,19.89 | U$11.1 57.15,59.66 57.61,59.21 57.61,55.78 v60.81,52.58
  Bottom 0.254: v60.81,52.58 61.27,52.12 61.49,52.12 68.81,44.81 68.81,33.6 v55.09,19.89
MIC_IN  (via drill 0.61)
  Top 0.254: C22.1 13.72,69.72 13.72,63.78 13.95,63.55 TP2.TP | v19.66,71.78 19.66,69.95 U$16.2
  Bottom 0.254: v19.66,71.78 19.66,69.04 14.17,63.55 TP2.TP
N$1  (via drill 0.61)
  Top 0.254: v85.27,8.69 83.44,8.69 R2.2
  Bottom 0.254: v85.27,8.69 90.07,3.89 100.13,3.89 SW2.4
N$2  (via drill 0.61)
  Top 0.254: U$12.1 77.5,21.03 77.5,16.23 C6.1 77.27,16 74.3,13.03 v66.52,13.03
  Bottom 0.254: v66.52,13.03 63.32,9.83 63.32,4.57 62.64,3.89 61.72,3.89 61.04,4.57 50.75,4.57 50.29,4.12 46.63,4.12 45.26,2.74 U$14.3
N$4
  Top 0.254: C8.1 52.81,50.98 52.81,53.26 49.84,56.24 49.84,58.29 U$11.16
N$5  (via drill 0.61)
  Top 0.254: 50.06,55.32 48.69,56.69 48.69,58.29 U$11.18 | 50.06,55.32 51.21,54.18 51.21,50.98 C8.2 | v58.98,55.78 62.18,58.98 62.18,61.27 C9.2 | 50.06,55.32 v50.06,54.63
  Bottom 0.254: v58.98,55.78 53.03,55.78 52.58,56.24 51.66,56.24 v50.06,54.63
N$6
  Top 0.254: R3.2 18.06,17.83 13.95,17.83 SW1.4
N$7
  Top 0.254: R4.2 16.92,6.17 16.23,6.17 13.95,3.89 SW0.4
N$8
  Top 0.254: R1.2 88.7,14.17 96.7,14.17 100.13,17.6 SW3.4
N$9  (via drill 0.61)
  Top 0.254: v76.35,29.26 74.52,29.26 R5.2 74.3,29.26 72.47,31.09 69.72,31.09 54.86,45.95 v48.01,45.95 | v34.06,25.38 34.06,24.69 33.15,23.77 32.46,23.77 U$6.14 | v34.06,30.4 34.06,38.18 31.09,41.15 31.09,46.86 v30.4,47.55
  Bottom 0.254: v76.35,29.26 93.95,29.26 95.1,28.12 U$9.B | v34.06,30.4 v34.06,25.38 | v30.4,47.55 46.41,47.55 v48.01,45.95
N$10  (via drill 0.61)
  Top 0.254: v58.98,62.87 62.18,62.87 C9.1 | v48.92,62.64 48.92,61.27 49.15,61.04 U$11.17
  Bottom 0.254: v58.98,62.87 53.03,62.87 51.89,61.72 49.84,61.72 v48.92,62.64
N$11  (via drill 0.61)
  Top 0.254: R9.2 18.06,28.12 13.49,28.12 12.34,29.26 7.54,29.26 6.4,28.12 U$8.A | v30.18,21.49 30.4,21.72 32.23,21.72 U$6.11
  Bottom 0.254: v30.18,21.49 30.18,22.17 28.12,24.23 19.66,24.23 16.92,26.98 7.32,26.98 6.4,27.89 U$8.A
N$12  (via drill 0.61)
  Top 0.254: R8.2 18.06,25.6 v16.92,25.6 13.72,25.6 11.43,27.89 U$8.B | v28.57,22.4 32.23,22.4 U$6.12
  Bottom 0.254: v28.57,22.4 20.12,22.4 v16.92,25.6
N$13  (via drill 0.61)
  Top 0.254: 77.27,26.75 74.52,26.75 R7.2 | v34.98,24.46 33.6,23.09 32.46,23.09 U$6.13 | v34.98,31.77 34.98,37.95 34.06,38.86 34.06,41.6 v34.52,42.06 | v41.38,45.72 42.98,47.32 v61.95,47.32 | v67.89,41.38 67.89,39.09 77.27,29.72 77.27,26.75 | 77.27,26.75 v77.5,26.75
  Bottom 0.254: v77.5,26.75 88.92,26.75 90.07,27.89 U$9.A | v34.98,31.77 v34.98,24.46 | v34.52,42.06 33.6,42.98 33.6,43.89 35.43,45.72 v41.38,45.72 | v67.89,41.38 v61.95,47.32
N$14  (via drill 0.61)
  Top 0.254: v33.38,57.15 31.77,58.75 C10.2 | v47.55,56.69 47.55,58.29 U$11.20
  Bottom 0.254: v33.38,57.15 38.41,57.15 41.15,54.41 44.35,54.41 46.63,56.69 v47.55,56.69
N$15
  Top 0.254: R10.2 16.92,10.06 15.09,10.06 13.95,8.91 SW0.2
N$16
  Top 0.254: R11.2 13.95,22.86 SW1.2
N$17
  Top 0.254: R12.2 83.44,6.4 97.84,6.4 100.13,8.69 SW2.2
N$18  (via drill 0.61)
  Top 0.254: v85.27,11.43 R13.2
  Bottom 0.254: v85.27,11.43 88.92,11.43 100.13,22.63 SW3.2
N$19  (via drill 0.61)
  Top 0.254: v36.58,65.38 31.77,60.58 C10.1 | v47.78,65.38 47.78,63.32 48.01,63.09 48.01,61.04 U$11.19
  Bottom 0.254: v47.78,65.38 v36.58,65.38
N$20
  Top 0.254: C12.1 42.06,68.81 42.06,63.78 44.12,61.72 44.12,61.04 U$11.27
N$21  (via drill 0.61)
  Top 0.254: v40.46,56.46 38.18,58.75 C13.1 | v42.75,55.32 44.58,57.15 44.58,58.29 U$11.26
  Bottom 0.254: v40.46,56.46 41.6,56.46 v42.75,55.32
N$22
  Top 0.254: C14.1 44.58,68.81 44.58,62.18 45.03,61.72 45.03,61.04 U$11.25
N$23  (via drill 0.61)
  Top 0.254: v48.23,54.41 48.23,53.03 C15.1 | v45.72,54.41 45.72,58.29 U$11.24
  Bottom 0.254: v45.72,54.41 v48.23,54.41
N$24
  Top 0.254: C16.1 46.86,68.81 46.86,63.78 46.18,63.09 46.18,61.04 U$11.23
N$25
  Top 0.254: R16.2 62.41,50.52 62.41,53.49 63.32,54.41 JP1.1
N$26
  Top 0.254: C11.2 50.75,68.81 50.75,63.32 50.29,62.87 50.29,61.04 U$11.15
N$27
  Top 0.254: Q1.3 69.72,58.52 69.72,57.15 67.21,54.63 66.06,54.63 JP1.2
N$28
  Top 0.254: U$14.2 42.06,3.66 42.06,6.63 F1.2
N$29
  Top 0.254: LED1.A 72.01,49.61 74.07,49.61 R6.1
N$30
  Top 0.254: LED2.A 72.01,47.09 74.07,47.09 R14.1
N$31
  Top 0.254: LED3.A 72.01,44.58 74.07,44.58 R15.1
N$32
  Top 0.254: LED4.A 53.95,1.37 53.95,2.29 52.58,3.66 R17.2
N$33
  Top 0.254: R20.2 70.64,63.32 70.64,60.81 Q1.1
N$34
  Top 0.254: C22.2 11.89,69.95 11.89,72.24 R21.1 11.66,72.47 9.37,72.47 7.09,74.75 U$17.OUT
N$35  (via drill 0.61)
  Top 0.254: 24.46,69.95 22.4,69.95 U$16.4 | 24.46,69.95 v24.46,71.09 24.46,72.24 C21.1 | 24.46,69.95 R23.2
  Bottom 0.254: v24.46,71.09 24.46,71.55 29.03,76.12 TP1.TP
N$37
  Top 0.254: C20.2 19.66,78.64 19.66,75.21 U$16.7
N$40
  Top 0.254: R18.1 17.6,44.81 15.32,44.81 C18.2 15.09,44.81 11.66,44.81 11.43,44.58 U$15.8
PDI  (via drill 0.61)
  Top 0.254: v54.86,28.35 54.86,29.72 U$1.34
  Bottom 0.254: v54.86,28.35 54.86,22.86 54.18,22.17 54.18,19.43 59.66,13.95 66.98,13.95 67.44,13.49 67.44,5.26 SV1.6
PWR_RAW  (via drill 0.61)
  Top 0.254: v46.41,10.52 44.58,8.69 42.06,8.69 F1.1 | v70.41,6.17 v61.04,6.17
  Bottom 0.254: v46.41,10.52 47.55,11.66 50.98,11.66 56.46,6.17 v61.04,6.17 | JP3.1 72.24,2.74 70.41,4.57 v70.41,6.17 72.69,8.46 72.69,26.98 75.67,29.95 75.67,31.77 79.78,35.89 79.78,40.69 U$13.+
RST/PDI_CLK  (via drill 0.61)
  Top 0.254: v52.58,27.89 52.81,27.89 53.95,29.03 53.95,29.72 U$1.35 | v46.86,15.09 40.92,9.14 40.92,7.77 34.98,1.83 21.03,1.83 U$7.1
  Bottom 0.254: v52.58,27.89 52.58,18.06 55.55,15.09 | 55.55,15.09 62.18,8.46 62.18,5.26 SV1.2 | 55.55,15.09 v46.86,15.09
SHIFT_LATCH  (via drill 0.61)
  Top 0.254: v56.46,30.63 56.46,28.12 U$1.33 | v30.63,24.23 30.86,24.46 32.23,24.46 U$6.15 | v30.63,26.06 33.38,26.06 33.83,26.52 v35.89,26.52 | v35.89,30.86 35.89,39.09 35.66,39.32 TP20.TP
  Bottom 0.254: v56.46,30.63 56.46,31.32 48.23,39.55 35.66,39.55 TP20.TP | v30.63,26.06 v30.63,24.23 | v35.89,30.86 v35.89,26.52
SHIFT_LOAD  (via drill 0.61)
  Top 0.254: v53.95,27.43 56.46,27.43 U$1.32 | v26.52,26.98 26.52,25.15 U$6.1
  Bottom 0.254: v53.95,27.43 53.95,27.89 47.78,34.06 33.6,34.06 | 33.6,34.06 30.86,34.06 30.63,34.29 TP19.TP | 33.6,34.06 v26.52,26.98
SPIC_MISO  (via drill 0.61)
  Top 0.254: 49.84,16.92 49.84,15.09 48.46,13.72 48.46,10.29 TP7.TP | 49.84,16.92 49.84,18.29 U$1.16 | v37.03,20.57 32.46,20.57 U$6.9 | 49.84,16.92 v48.46,16.92
  Bottom 0.254: v37.03,20.57 44.81,20.57 v48.46,16.92
SPIC_SCK  (via drill 0.61)
  Top 0.254: v49.84,13.72 49.84,14.17 50.75,15.09 50.75,18.29 U$1.17 | v27.89,25.15 27.2,24.46 26.52,24.46 U$6.2
  Bottom 0.254: v49.84,13.72 45.49,13.72 39.55,19.66 34.52,19.66 32.46,21.72 32.46,29.26 32,29.72 31.09,29.72 27.89,26.52 v27.89,25.15
SPID_MISO  (via drill 0.61)
  Top 0.254: TP8.TP 62.18,20.34 60.12,22.4 56.69,22.4 U$1.26 56.46,22.63 52.35,22.63 v49.84,25.15 | v33.15,31.32 33.15,33.83 26.52,40.46 25.6,40.46 TP16.TP
  Bottom 0.254: U$15.3 6.4,51.89 17.6,40.69 25.38,40.69 TP16.TP | v49.84,25.15 49.84,29.95 46.63,33.15 34.98,33.15 v33.15,31.32
SPID_MOSI  (via drill 0.61)
  Top 0.254: v55.09,21.72 56.46,21.72 U$1.25
  Bottom 0.254: v55.09,21.72 56.24,21.72 67.21,32.69 67.21,35.43 TP15.TP
SPID_SCK  (via drill 0.61)
  Top 0.254: v51.66,25.38 53.49,23.55 56.46,23.55 U$1.27
  Bottom 0.254: v51.66,25.38 51.66,28.8 46.86,33.6 34.06,33.6 27.43,26.98 27.43,26.52 26.98,26.06 26.06,26.06 21.72,30.4 21.72,32.92 TP17.TP 21.49,33.15 21.49,36.12 11.89,45.72 10.97,45.72 4.8,51.89 3.89,51.89 U$15.4
SPID_SS
  Top 0.254: U$1.24 56.69,21.03 59.44,21.03 65.38,15.09 71.78,15.09 72.69,16 72.69,20.12 67.44,25.38 TP14.TP
SW0  (via drill 0.61)
  Top 0.254: v29.26,24.46 28.57,23.77 26.52,23.77 U$6.3
  Bottom 0.254: v29.26,24.46 29.26,23.77 31.09,21.95 31.09,21.03 15.77,5.71 3.2,5.71 1.37,3.89 SW0.3
SW1  (via drill 0.61)
  Top 0.254: v22.17,21.49 23.77,23.09 26.29,23.09 U$6.4
  Bottom 0.254: v22.17,21.49 15.09,21.49 12.8,19.2 2.74,19.2 1.37,17.83 SW1.3
SW2  (via drill 0.61)
  Top 0.254: v37.03,12.12 27.66,21.49 27.66,22.17 27.43,22.4 26.52,22.4 U$6.5 | v43.43,6.63 45.95,4.12 50.75,4.12 v51.21,3.66 | v69.49,4.12 70.18,4.12 73.15,7.09 v80.47,7.09
  Bottom 0.254: v37.03,12.12 37.03,9.83 40.23,6.63 v43.43,6.63 | v51.21,3.66 59.44,3.66 61.72,1.37 67.89,1.37 69.49,2.97 v69.49,4.12 | v80.47,7.09 84.35,7.09 SW2.3
SW3  (via drill 0.61)
  Top 0.254: v34.98,3.2 24.23,13.95 24.23,20.57 25.38,21.72 26.29,21.72 U$6.6 | v59.66,2.06 61.04,2.06 61.72,1.37 68.81,1.37 72.69,5.26 v75.89,5.26
  Bottom 0.254: v34.98,3.2 37.03,1.14 58.75,1.14 v59.66,2.06 | v75.89,5.26 75.89,5.94 87.55,17.6 SW3.3
TEMP_SENSOR
  Top 0.254: JP2.1 R19.2 | U$1.40 49.84,29.95 49.84,40.23 45.72,44.35 TP21.TP
  Bottom 0.254: JP2.1 3.89,57.15 3.89,56.24 7.54,52.58 7.54,51.66 12.57,46.63 43.66,46.63 45.72,44.58 TP21.TP
TWIC_SCL  (via drill 0.61)
  Top 0.254: U$1.11 45.03,20.12 v45.03,18.29 39.55,12.8 TP5.TP | v52.12,55.32 51.66,55.78 51.66,58.29 U$11.12 | v38.41,36.58 38.41,31.09 v39.55,29.95
  Bottom 0.254: v52.12,55.32 52.12,48.69 45.72,42.29 36.35,42.29 34.06,40.01 34.06,38.86 36.35,36.58 v38.41,36.58 | v39.55,29.95 45.72,23.77 45.72,21.03 49.38,17.37 49.38,16.46 48.92,16 47.32,16 v45.03,18.29
TWIC_SDA  (via drill 0.61)
  Top 0.254: U$1.10 45.03,20.8 42.98,20.8 40.01,17.83 39.55,17.83 TP6.TP | v51.44,62.64 51.21,62.41 51.21,61.04 U$11.13 | v3.43,38.18 5.26,36.35 5.26,11.43 v11.89,4.8
  Bottom 0.254: v51.44,62.64 50.29,62.64 48.46,64.47 17.14,64.47 13.49,60.81 2.52,60.81 1.83,60.12 1.83,39.78 v3.43,38.18 | v11.89,4.8 12.34,5.26 24.69,5.26 37.03,17.6 39.32,17.6 TP6.TP
USART_RXC0  (via drill 0.61)
  Top 0.254: 37.95,10.29 31.77,10.29 TP24.TP | 37.95,10.29 39.09,10.29 46.63,17.83 46.63,18.29 U$1.12 | v71.55,48.23 70.41,49.38 LED1.C 70.18,49.38 62.64,41.83 v62.18,41.83 | v37.95,24.46 37.95,10.29 | v37.95,30.18 37.95,35.66 37.03,36.58 37.03,40.46 v36.8,40.69
  Bottom 0.254: v71.55,48.23 71.55,48.69 76.58,53.72 76.58,68.81 75.44,69.95 U$10.2 | v37.95,30.18 v37.95,24.46 | v36.8,40.69 37.95,41.83 v62.18,41.83
USART_TXC0  (via drill 0.61)
  Top 0.254: TP25.TP 35.66,6.4 36.35,6.4 47.55,17.6 47.55,18.29 U$1.13 47.55,18.52 v47.55,20.8 | 70.41,45.95 70.41,46.86 LED2.C | v43.43,34.98 v46.18,32.23 | v43.43,38.63 43.43,43.89 42.29,45.03 42.29,45.95 43.2,46.86 55.78,46.86 61.72,40.92 65.38,40.92 70.41,45.95 | 70.41,45.95 v70.41,45.72
  Bottom 0.254: v70.41,45.72 77.04,52.35 77.04,72.01 75.67,73.38 74.98,73.38 74.07,72.47 74.07,69.27 75.21,68.12 U$10.3 | v47.55,20.8 47.55,22.4 46.18,23.77 v46.18,32.23 | v43.43,38.63 v43.43,34.98
XBEE_RSSI
  Top 0.254: R15.2 75.89,44.58 75.89,45.49 77.04,46.63 77.04,72.01 75.67,73.38 74.98,73.38 74.07,72.47 74.07,63.32 75.21,62.18 U$10.6